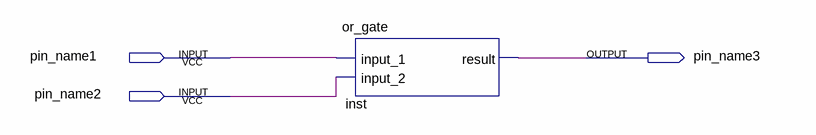
[diagram p0: schematic sheet]
// Quartus schematic orgate.bdf as structural Verilog: 1 symbols, 3 pins
module orgate (
  input  pin_name1,
  input  pin_name2,
  output pin_name3
);

  or_gate inst (.input_1(pin_name1), .input_2(pin_name2), .result(pin_name3));
endmodule
